# EAGLE design Adafruit MAX31865 (EAGLE 9.6.2)
COMPANY: ADAFRUIT INDUSTRIES; DRAWN: KTOWN; REV: A
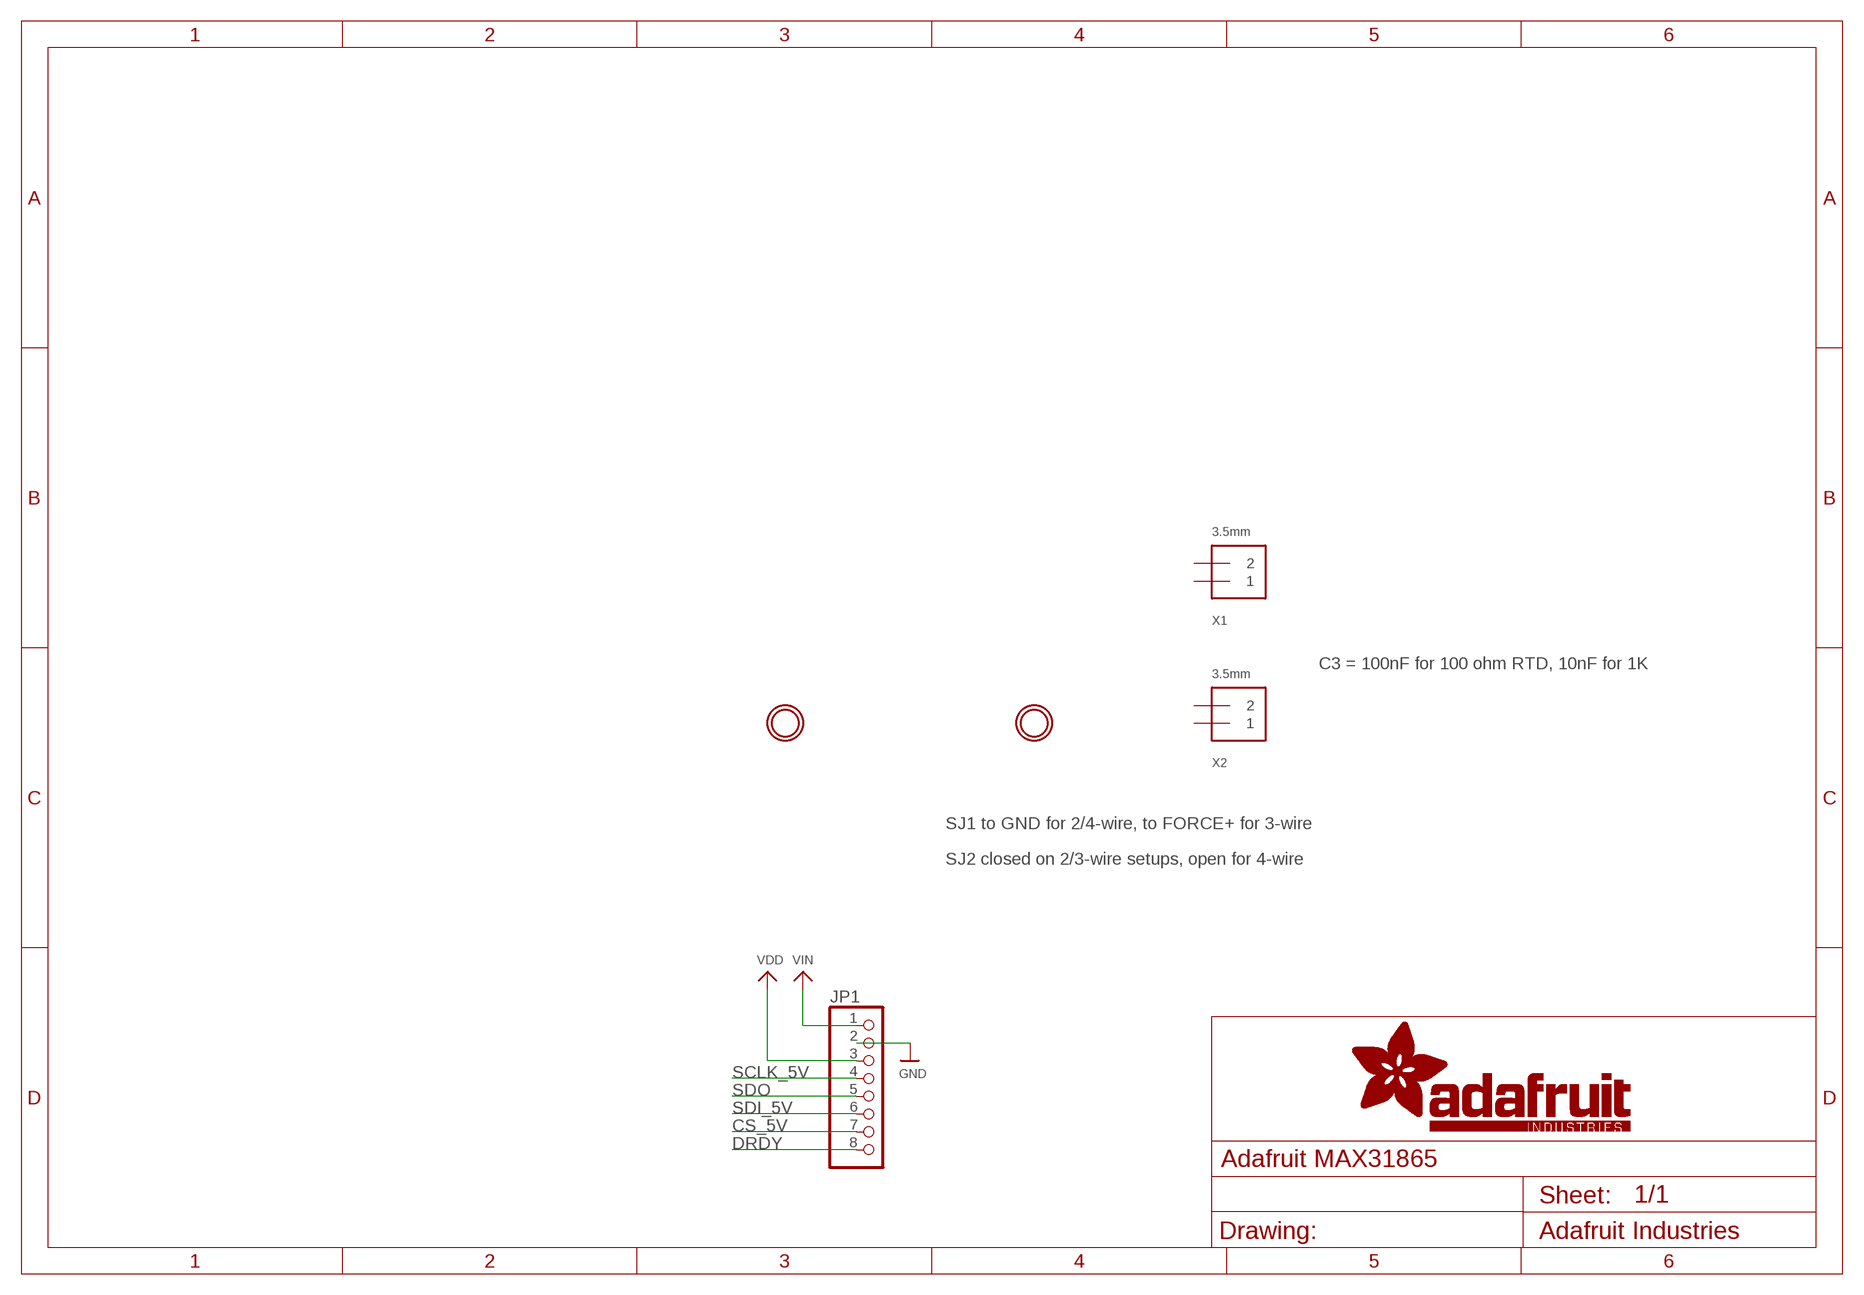
[diagram p0: schematic, sheet 1]

## Parts
JP1  HEADER-1X870MIL  [1X08_ROUND_70]
U$18  MOUNTINGHOLE2.5  [MOUNTINGHOLE_2.5_PLATED]
U$19  MOUNTINGHOLE2.5  [MOUNTINGHOLE_2.5_PLATED]
X1  3.5mm  TERMBLOCK_1X2  [TERMBLOCK_1X2-3.5MM]
X2  3.5mm  TERMBLOCK_1X2  [TERMBLOCK_1X2-3.5MM]

## Nets
CS_5V: JP1.7
DRDY: JP1.8
GND: JP1.2
SCLK_5V: JP1.4
SDI_5V: JP1.6
SDO: JP1.5
VDD: JP1.3
VIN: JP1.1
Unconnected: X1.1 X1.2 X2.1 X2.2

## Notes on the sheet
- C3 = 100nF for 100 ohm RTD, 10nF for 1K
- SJ1 to GND for 2/4-wire, to FORCE+ for 3-wire
- SJ2 closed on 2/3-wire setups, open for 4-wire

## Library data of the parts
JP1 = microbuilder:HEADER-1X8: PIN HEADER
U$18 U$19 = microbuilder:MOUNTINGHOLE: Mounting Hole For #2 screws (0.086"/2.18mm width, 0.094"/2.4mm hole) use 2.5mm; BOM: EXCLUDE
X1 X2 = microbuilder:TERMBLOCK_1X2: 3.5mm Terminal block http://www.ladyada.net/library/pcb/eaglelibrary.html

## Board
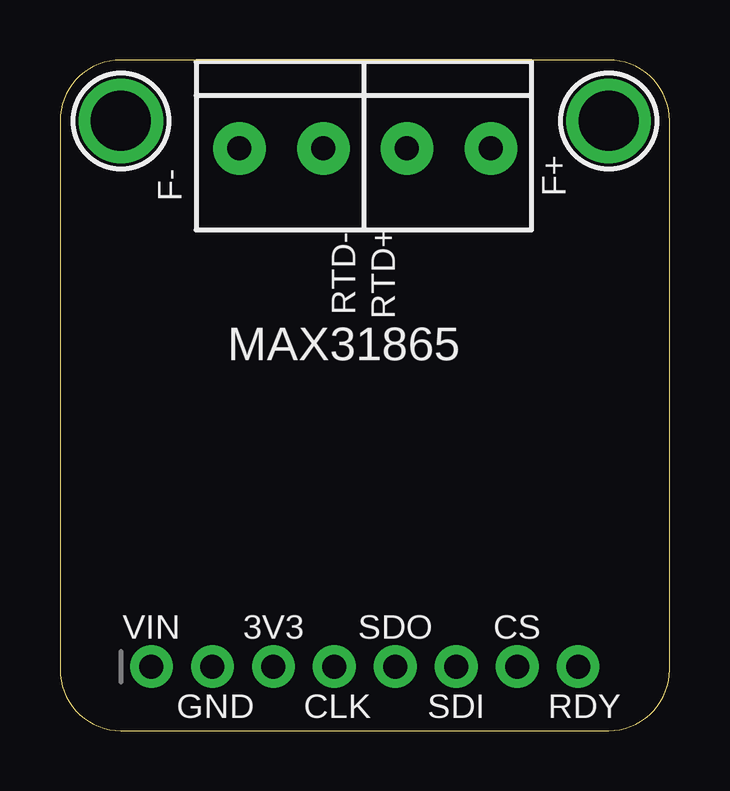
[diagram p1: board, top side]
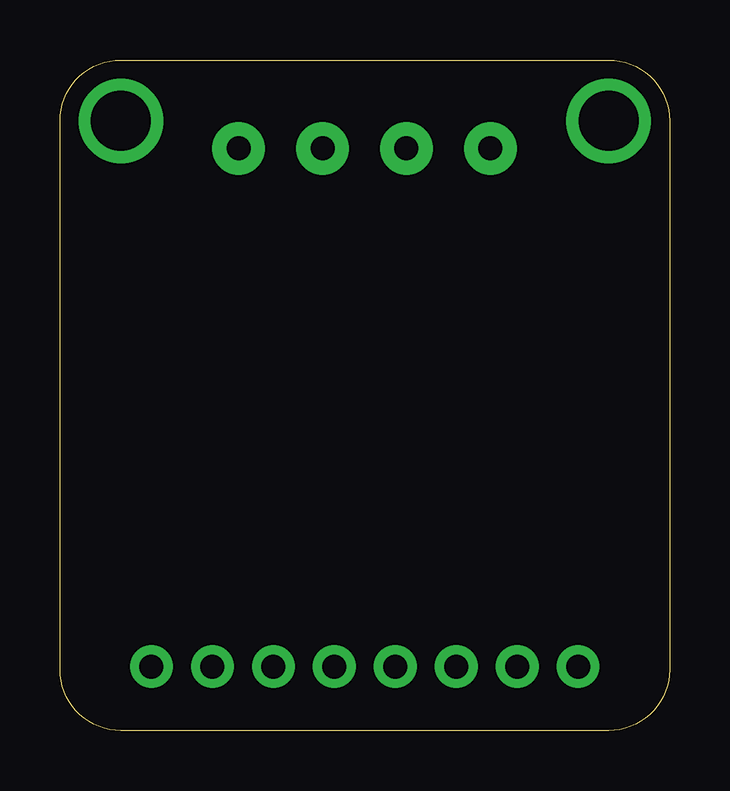
[diagram p2: board, bottom side, seen from below]

Size 25.4 x 27.94 mm. Coordinates in mm from the lower left corner, seen from the top.
Outline: 2.54,0 22.86,0 arc90 25.4,2.54 25.4,25.4 arc90 22.86,27.94 2.54,27.94 arc90 0,25.4 0,2.54 arc90 2.54,0
Copper layers (1*16): Top 0.035mm / dielectric 1.5mm / Bottom 0.035mm
Design rules "adafruit *": minimum track width 8mil, minimum drill 15.5mil, track to track 8mil, track to pad 8mil, pad to pad 8mil, via to via 8mil, smd to smd 8mil, copper to edge 10mil, drill to drill 8mil, minimum pad ring 10mil, minimum via ring 8mil, stop-mask expansion 2mil, vias tented up to drill 20mil, thermal gap 10mil

### Footprints (pad centres in the part's own frame; a part is rotated, then mirrored left to right if it is on the bottom)
1X08_ROUND_70 = drill 1 pad 1.778: 1 -8.89,0; 2 -6.35,0; 3 -3.81,0; 4 -1.27,0; 5 1.27,0; 6 3.81,0; 7 6.35,0; 8 8.89,0
MOUNTINGHOLE_2.5_PLATED = drill 2.5 pad 3.2: P$1 0,0
TERMBLOCK_1X2-3.5MM = drill 1 pad 2.184: 1 1.8,0; 2 -1.7,0

### Placement (x,y rotation side)
JP1  12.7,2.67 0 top
U$18  2.54,25.4 0 top
U$19  22.86,25.4 0 top
X1  16.26,24.26 180 top
X2  9.27,24.26 180 top

### Tracks (layer width: path | path; a pad name or v marks a point on that pad's centre or on a via)
SCLK_5V
  Top 0.305: 11.56,2.67 JP1.4
SDO
  Bottom 0.254: 14.1,2.79 JP1.5
  Bottom 0.305: 14.22,2.92 JP1.5

### Text on the board
tPlace: F- | F+ | RTD- | RTD+ | MAX31865 | VIN | 3V3 | SDO | CS | GND | CLK | SDI | RDY